# Altium schematic sheet activity_tracker_tester.SchDoc: emitter 14ch
size A4; DrawnBy: Simon Laube; DocumentNumber: 1; Revision: 0; SheetNumber: 1; SheetTotal: 2
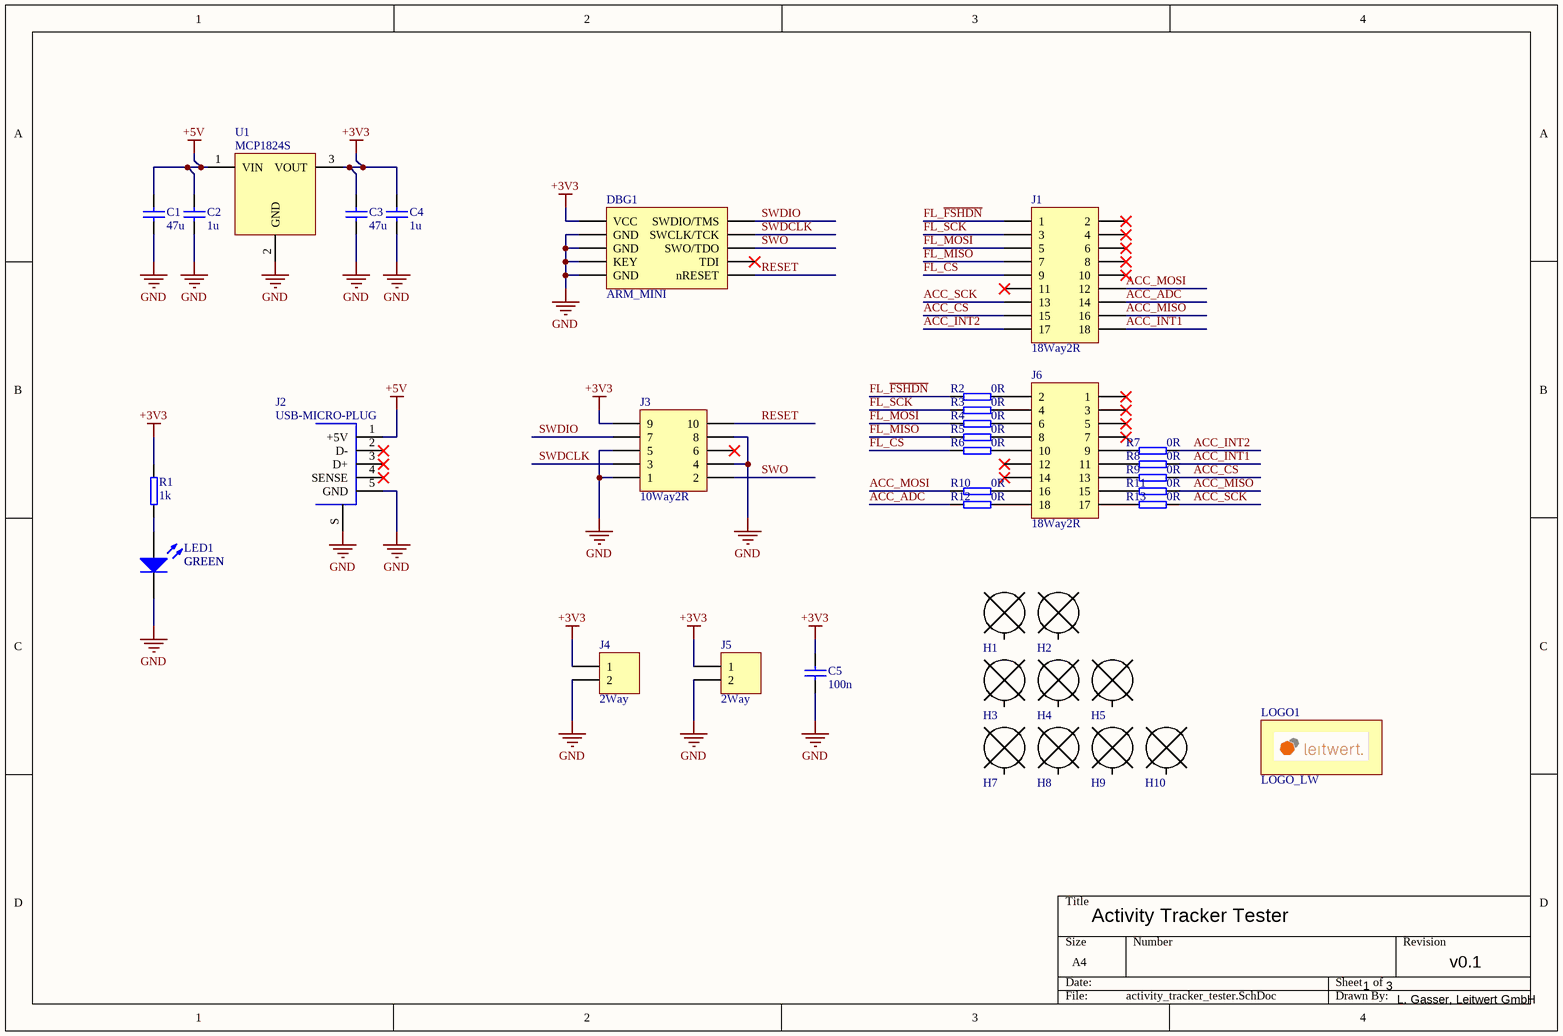
[diagram p0: activity_tracker_tester.SchDoc]

## Parts
C1  47u  [CAPC3216X18N]
C2  1u  [CAPC1608X95N]
C3  47u  [CAPC3216X18N]
C4  1u  [CAPC1608X95N]
C5  100n  [CAPC1608X95N]
DBG1  ARM_MINI  [R127_M50-3500542]
H1  HOLE  [M1_SMALL]  (value not drawn)  (no BOM)
H2  HOLE  [M1_SMALL]  (value not drawn)  (no BOM)
H3  HOLE  [M1_SMALL_NOKEEPOUT]  (value not drawn)  (no BOM)
H4  HOLE  [M1_SMALL_NOKEEPOUT]  (value not drawn)  (no BOM)
H5  HOLE  [M1_SMALL_NOKEEPOUT]  (value not drawn)  (no BOM)
H7  HOLE  [M3_PLATED_MEDIUM]  (value not drawn)  (no BOM)
H8  HOLE  [M3_PLATED_MEDIUM]  (value not drawn)  (no BOM)
H9  HOLE  [M3_PLATED_MEDIUM]  (value not drawn)  (no BOM)
H10  HOLE  [M3_PLATED_MEDIUM]  (value not drawn)  (no BOM)
J1  18Way2R  [THT_2x9_R254]
J2  USB-MICRO-PLUG  [475890001]
J3  10Way2R  [R127_M50-3500542]
J4  2Way  [2PINR254]
J5  2Way  [2PINR254]
J6  18Way2R  [R127_M50-3500942]
LED1  GREEN  [LED0603]
LOGO1  LOGO_LW  [LW_MWOB_30MM_BW_VEC]  (no BOM)
R1  1k  [RESC1608X55N]
R2  0R  [RESC1608X55N]
R3  0R  [RESC1608X55N]
R4  0R  [RESC1608X55N]
R5  0R  [RESC1608X55N]
R6  0R  [RESC1608X55N]
R7  0R  [RESC1608X55N]
R8  0R  [RESC1608X55N]
R9  0R  [RESC1608X55N]
R10  0R  [RESC1608X55N]
R11  0R  [RESC1608X55N]
R12  0R  [RESC1608X55N]
R13  0R  [RESC1608X55N]
U1  MCP1824S  [SOT223P700X180-4N]

## Nets
+3V3: C3.2 C4.2 C5.2 DBG1.1(VCC) J3.9 J4.1 J5.1 R1.2 U1.3(VOUT)
+5V: C1.2 C2.2 J2.1(+5V) U1.1(VIN)
GND: C1.1 C2.1 C3.1 C4.1 C5.1 DBG1.3(GND) DBG1.5(GND) DBG1.7(KEY) DBG1.9(GND) J2.5(GND) J2.S(SHIELD) J3.1 J3.4 J3.5 J3.8 J4.2 J5.2 LED1.2(K) U1.2(GND)
ACC_ADC: J1.14 R12.1
ACC_~{CS}: J1.15 R9.2
ACC_INT1: J1.18 R8.2
ACC_INT2: J1.17 R7.2
ACC_MISO: J1.16 R11.2
ACC_MOSI: J1.12 R10.1
ACC_SCK: J1.13 R13.2
FL_~{CS}: J1.9 R6.1
FL_~{FSHDN}: J1.1 R2.1
FL_MISO: J1.7 R5.1
FL_MOSI: J1.5 R4.1
FL_SCK: J1.3 R3.1
RESET: DBG1.10(nRESET) J3.10
SWDCLK: DBG1.4(SWCLK/TCK) J3.3
SWDIO: DBG1.2(SWDIO/TMS) J3.7
SWO: DBG1.6(SWO/TDO) J3.2
NetJ6_2: J6.2 R2.2
NetJ6_4: J6.4 R3.2
NetJ6_6: J6.6 R4.2
NetJ6_8: J6.8 R5.2
NetJ6_9: J6.9 R7.1
NetJ6_10: J6.10 R6.2
NetJ6_11: J6.11 R8.1
NetJ6_13: J6.13 R9.1
NetJ6_15: J6.15 R11.1
NetJ6_16: J6.16 R10.2
NetJ6_17: J6.17 R13.1
NetJ6_18: J6.18 R12.2
NetLED1_1: LED1.1(A) R1.1

Not connected (* = marked no-connect by the designer): DBG1 8(TDI)*; H1 H; H2 H; H3 H; H4 H; H5 H; H7 H; H8 H; H9 H; H10 H; J1 2* 4* 6* 8* 10* 11*; J2 2(D-)* 3(D+)* 4(SENSE)*; J3 6*; J6 1* 3* 5* 7* 12* 14*

## Notes on the sheet
- Activity Tracker Tester
- v0.1
- 1
- 3
- L. Gasser, Leitwert GmbH

## Library data of the parts
C1 C3 = C: Capacitor; Voltage: 6.3V; Value: 47u; Supplier 1: Digi-Key; Supplier Part Number 1: 311-1993-1-ND; ClassName: directConnect
C2 C4 C5 = C: Capacitor; Voltage: 10V; Supplier 1: Digi-Key; Supplier Part Number 1: 1276-1863-1-ND
  C2 C4: Value: 1u
  C5: Value: 100n
DBG1 = ARM_MINI: ARM Mini JTAG / SWD 10-pin connector; Supplier 1: Digi-Key; Supplier Part Number 1: 952-1383-ND
J1 J6 = 18Way2R: 18 Way 2 Row Connector; ClassName: directConnect; Supplier 1: Digi-Key
  J1: Supplier Part Number 1: 952-1825-ND
  J6: Supplier Part Number 1: ED90491-ND
J2 = USB-MICRO-PLUG: USB Micro Plug; ClassName: directConnect; Supplier 1: Digi-Key; Supplier Part Number 1: WM17143CT-ND
J3 = 10Way2R: 10 Way 2 Row Connector; ClassName: directConnect; Supplier 1: Digi-Key; Supplier Part Number 1: ED90491-ND
J4 J5 = 2Way: 2 Way Connector; ClassName: directConnect; Supplier 1: Digi-Key
  J4: Supplier Part Number 1: ED8201-02-ND
  J5: Supplier Part Number 1: 952-2262-ND
LED1 = LED: Color: GREEN; Supplier 1: Digi-Key; Supplier Part Number 1: 160-1475-1-ND
LOGO1 = LOGO_LW: Leitwert Logo; ClassName: logoStyle1
R1-R13 = R: Resistor; Supplier 1: Digi-Key
  R1: Value: 1k; Supplier Part Number 1: 1276-5062-1-ND
  R2-R13: Value: 0R; Supplier Part Number 1: 311-0.0GRCT-ND
U1 = MCP1824S: 300 mA, Low Voltage, Low Quiescent Current LDO Regulator; Supplier 1: Digi-Key; Supplier Part Number 1: MCP1824ST-3302E/DBCT-ND; ClassName: directConnect
H1-H5 H7-H10 = HOLE: ClassName: directConnect